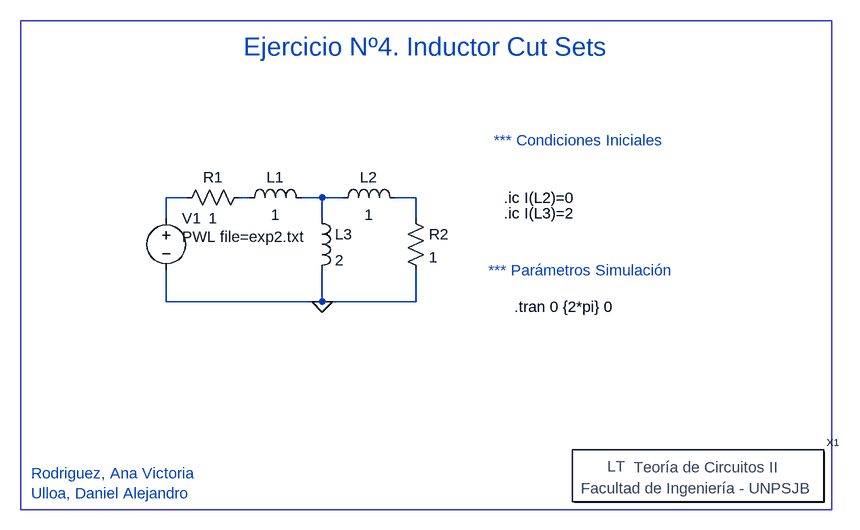
[diagram p0: schematic 04.asc]
04.asc, the LTspice schematic file:
Version 4
SHEET 1 880 680
WIRE -176 48 -208 48
WIRE -80 48 -96 48
WIRE 32 48 0 48
WIRE 64 48 32 48
WIRE 176 48 144 48
WIRE -208 80 -208 48
WIRE 32 80 32 48
WIRE 176 80 176 48
WIRE -208 208 -208 160
WIRE 32 208 32 160
WIRE 32 208 -208 208
WIRE 176 208 176 160
WIRE 176 208 32 208
FLAG 32 208 0
SYMBOL Circuitos2\\Letreros\\Teoría\ de\ Circuitos\ II 608 480 R0
SYMATTR InstName X1
SYMBOL voltage -208 64 R0
WINDOW 123 0 0 Left 0
WINDOW 39 0 0 Left 0
WINDOW 3 24 44 Left 2
SYMATTR Value PWL file=exp2.txt
SYMATTR InstName V1
SYMBOL res -80 32 R90
WINDOW 0 0 56 VBottom 2
WINDOW 3 32 56 VTop 2
SYMATTR InstName R1
SYMATTR Value 1
SYMBOL ind -96 64 R270
WINDOW 0 32 56 VTop 2
WINDOW 3 5 56 VBottom 2
SYMATTR InstName L1
SYMATTR Value 1
SYMBOL ind 48 64 R270
WINDOW 0 32 56 VTop 2
WINDOW 3 5 56 VBottom 2
SYMATTR InstName L2
SYMATTR Value 1
SYMBOL ind 16 64 R0
SYMATTR InstName L3
SYMATTR Value 2
SYMBOL res 160 64 R0
SYMATTR InstName R2
SYMATTR Value 1
TEXT 328 216 Left 2 !.tran 0 {2*pi} 0
TEXT 312 48 Left 2 !.ic I(L2)=0
TEXT 192 -184 Center 4 ;Ejercicio Nº4. Inductor Cut Sets
TEXT -416 472 Left 2 ;Rodriguez, Ana Victoria\nUlloa, Daniel Alejandro
TEXT 296 -40 Left 2 ;*** Condiciones Iniciales
TEXT 288 160 Left 2 ;*** Parámetros Simulación
TEXT 312 72 Left 2 !.ic I(L3)=2
RECTANGLE Normal 816 528 -432 -224

The netlist it stands for:
* 04.asc
XX1 Teoría de Circuitos II
V1 N001 0 PWL file=exp2.txt
R1 N002 N001 1
L1 N002 N003 1
L2 N003 N004 1
L3 N003 0 2
R2 N004 0 1
.tran 0 {2*pi} 0
.ic I(L2)=0
* Ejercicio Nº4. Inductor Cut Sets
* Rodriguez, Ana Victoria
* Ulloa, Daniel Alejandro
* *** Condiciones Iniciales
* *** Parámetros Simulación
.ic I(L3)=2
.backanno
.end